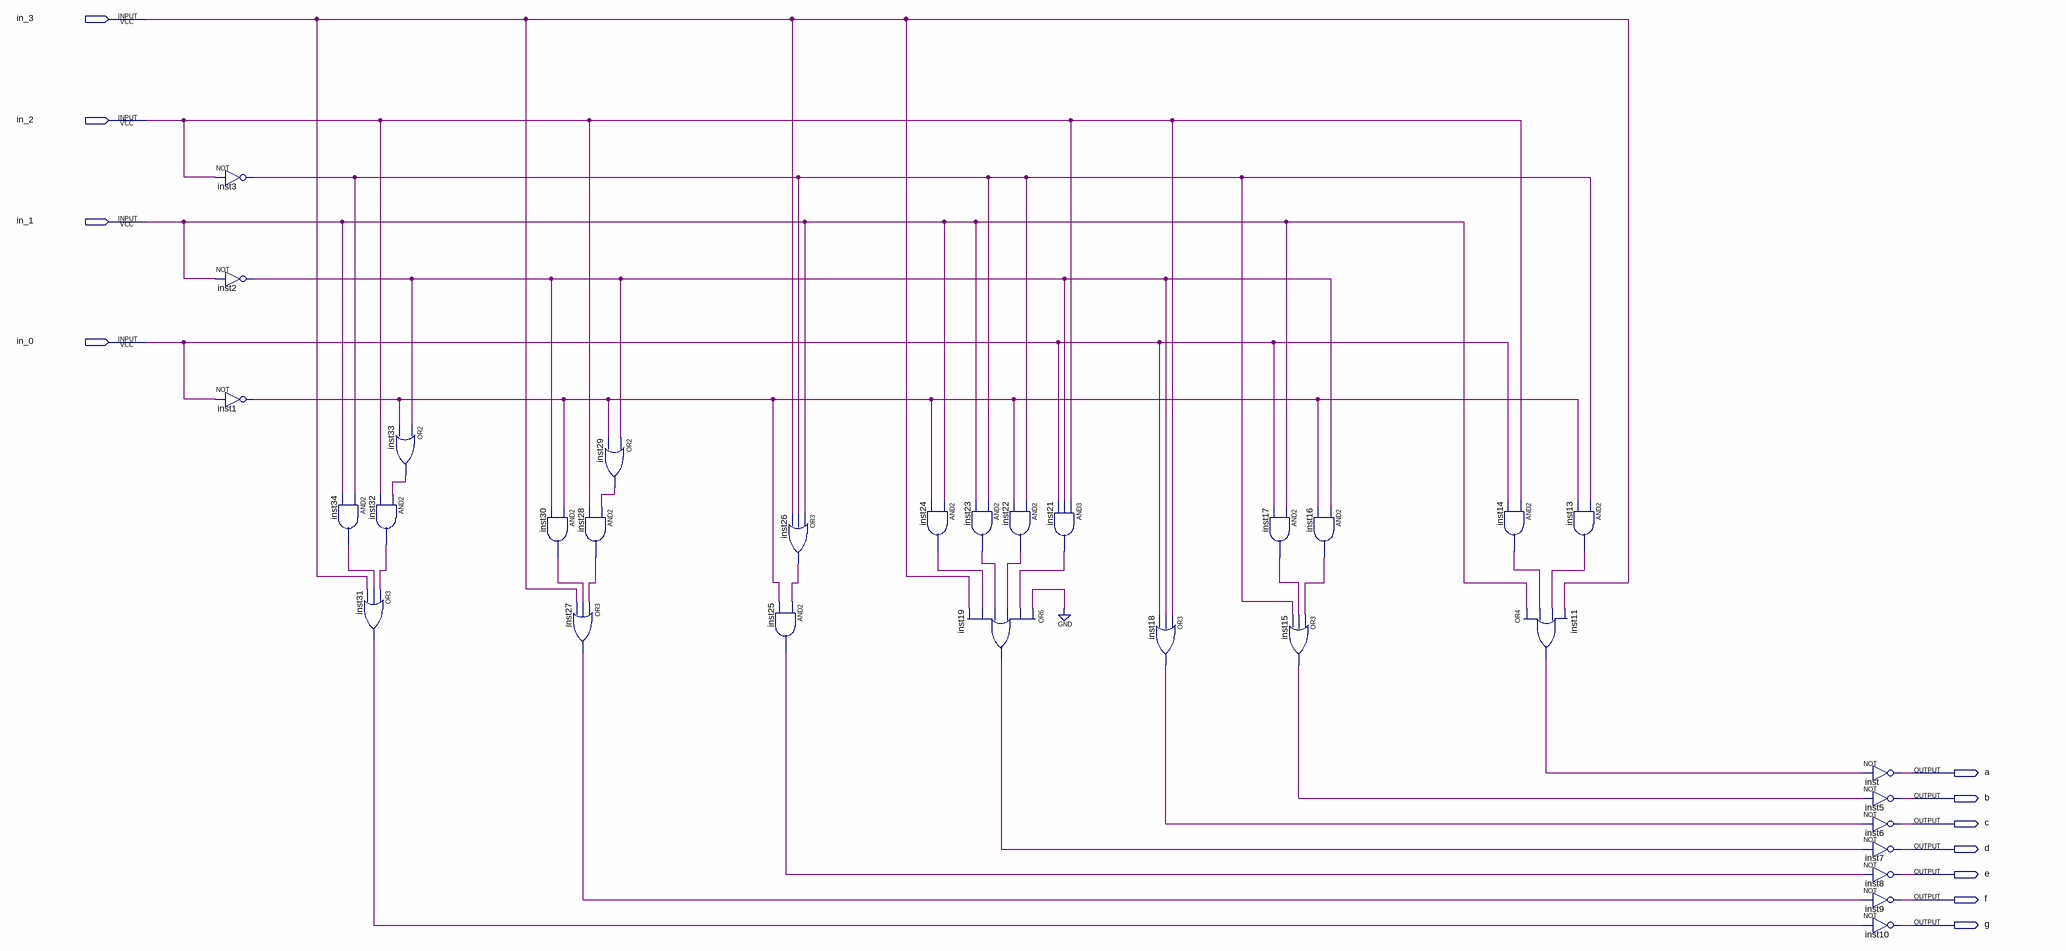
[diagram p0: schematic sheet]
// Quartus schematic dec7seg.bdf as structural Verilog: 32 symbols, 11 pins
module dec7seg (
  input  in_3,
  input  in_2,
  input  in_1,
  input  in_0,
  output a,
  output b,
  output c,
  output d,
  output e,
  output f,
  output g
);

  wire inst1_out, inst2_out, inst3_out, inst11_out, inst13_out, inst14_out, inst15_out, inst16_out,
       inst17_out, inst18_out, inst19_out, inst21_out, inst22_out, inst23_out, inst24_out, inst25_out,
       inst26_out, inst27_out, inst28_out, inst29_out, inst30_out, inst31_out, inst32_out, inst33_out,
       inst34_out;

  not inst3 (inst3_out, in_2);
  not inst2 (inst2_out, in_1);
  not inst1 (inst1_out, in_0);
  and inst34 (inst34_out, inst3_out, in_1);
  and inst32 (inst32_out, inst33_out, in_2);
  or inst31 (inst31_out, inst32_out, inst34_out, in_3);
  or inst33 (inst33_out, inst2_out, inst1_out);
  and inst28 (inst28_out, inst29_out, in_2);
  and inst30 (inst30_out, inst1_out, inst2_out);
  or inst27 (inst27_out, inst28_out, inst30_out, in_3);
  or inst29 (inst29_out, inst2_out, inst1_out);
  or inst26 (inst26_out, in_1, inst3_out, in_3);
  and inst25 (inst25_out, inst26_out, inst1_out);
  and inst24 (inst24_out, in_1, inst1_out);
  and inst23 (inst23_out, inst3_out, in_1);
  or inst19 (inst19_out, 1'b0, inst21_out, inst22_out, inst23_out, inst24_out, in_3);
  and inst22 (inst22_out, inst3_out, inst1_out);
  and inst21 (inst21_out, in_2, inst2_out, in_0);
  or inst18 (inst18_out, in_2, inst2_out, in_0);
  and inst17 (inst17_out, in_1, in_0);
  or inst15 (inst15_out, inst16_out, inst17_out, inst3_out);
  and inst16 (inst16_out, inst2_out, inst1_out);
  and inst14 (inst14_out, in_2, in_0);
  or inst11 (inst11_out, in_1, inst14_out, inst13_out, in_3);
  and inst13 (inst13_out, inst3_out, inst1_out);
  not inst (a, inst11_out);
  not inst5 (b, inst15_out);
  not inst6 (c, inst18_out);
  not inst7 (d, inst19_out);
  not inst8 (e, inst25_out);
  not inst9 (f, inst27_out);
  not inst10 (g, inst31_out);
endmodule
